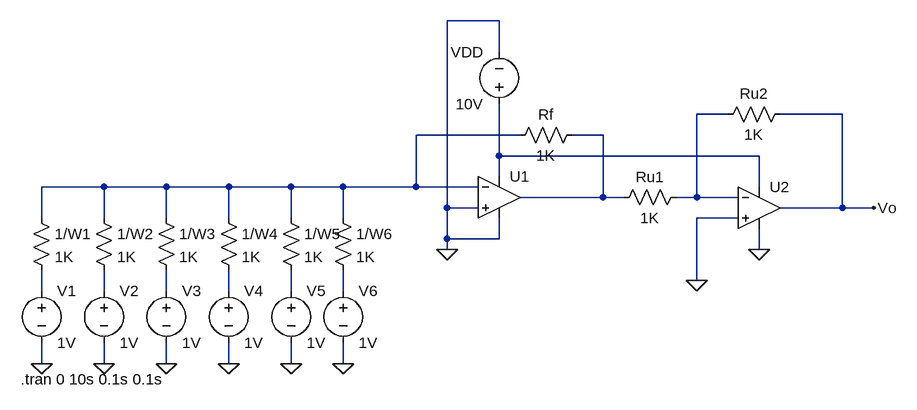
[diagram p0: schematic neuron-0.1.asc]
neuron-0.1.asc, the LTspice schematic file:
Version 4
SHEET 1 880 680
WIRE 256 -96 176 -96
WIRE 256 -48 256 -96
WIRE 608 48 560 48
WIRE 784 48 688 48
WIRE 288 80 128 80
WIRE 416 80 368 80
WIRE 256 112 256 32
WIRE 656 112 256 112
WIRE 256 144 256 112
WIRE -352 160 -448 160
WIRE -256 160 -352 160
WIRE -160 160 -256 160
WIRE -64 160 -160 160
WIRE 16 160 -64 160
WIRE 128 160 128 80
WIRE 128 160 16 160
WIRE 224 160 128 160
WIRE 656 160 656 112
WIRE 416 176 416 80
WIRE 416 176 288 176
WIRE 448 176 416 176
WIRE 560 176 560 48
WIRE 560 176 528 176
WIRE 624 176 560 176
WIRE 176 192 176 -96
WIRE 224 192 176 192
WIRE 784 192 784 48
WIRE 784 192 688 192
WIRE 832 192 784 192
WIRE -448 208 -448 160
WIRE -352 208 -352 160
WIRE -256 208 -256 160
WIRE -160 208 -160 160
WIRE -64 208 -64 160
WIRE 16 208 16 160
WIRE 624 208 560 208
WIRE 176 240 176 192
WIRE 256 240 256 208
WIRE 256 240 176 240
WIRE 176 256 176 240
WIRE 656 256 656 224
WIRE 560 304 560 208
WIRE -448 320 -448 288
WIRE -352 320 -352 288
WIRE -256 320 -256 288
WIRE -160 320 -160 288
WIRE -64 320 -64 288
WIRE 16 320 16 288
WIRE -448 432 -448 400
WIRE -352 432 -352 400
WIRE -256 432 -256 400
WIRE -160 432 -160 400
WIRE -64 432 -64 400
WIRE 16 432 16 400
FLAG 176 256 0
FLAG -448 432 0
FLAG -352 432 0
FLAG -256 432 0
FLAG -160 432 0
FLAG -64 432 0
FLAG 16 432 0
FLAG 656 256 0
FLAG 832 192 Vo
FLAG 560 304 0
SYMBOL OpAmps\\UniversalOpAmp 256 176 R0
SYMATTR InstName U1
SYMBOL voltage 256 48 R180
WINDOW 0 24 96 Left 2
WINDOW 3 24 16 Left 2
SYMATTR InstName VDD
SYMATTR Value 10V
SYMBOL voltage -352 304 R0
SYMATTR InstName V2
SYMATTR Value 1V
SYMBOL voltage -448 304 R0
SYMATTR InstName V1
SYMATTR Value 1V
SYMBOL voltage -256 304 R0
SYMATTR InstName V3
SYMATTR Value 1V
SYMBOL voltage -160 304 R0
SYMATTR InstName V4
SYMATTR Value 1V
SYMBOL voltage -64 304 R0
SYMATTR InstName V5
SYMATTR Value 1V
SYMBOL voltage 16 304 R0
SYMATTR InstName V6
SYMATTR Value 1V
SYMBOL res -464 192 R0
SYMATTR InstName 1/W1
SYMATTR Value 1K
SYMBOL res -368 192 R0
SYMATTR InstName 1/W2
SYMATTR Value 1K
SYMBOL res -272 192 R0
SYMATTR InstName 1/W3
SYMATTR Value 1K
SYMBOL res -176 192 R0
SYMATTR InstName 1/W4
SYMATTR Value 1K
SYMBOL res -80 192 R0
SYMATTR InstName 1/W5
SYMATTR Value 1K
SYMBOL res 0 192 R0
SYMATTR InstName 1/W6
SYMATTR Value 1K
SYMBOL res 384 64 R90
WINDOW 0 0 56 VBottom 2
WINDOW 3 32 56 VTop 2
SYMATTR InstName Rf
SYMATTR Value 1K
SYMBOL OpAmps\\UniversalOpAmp 656 192 R0
SYMATTR InstName U2
SYMBOL res 544 160 R90
WINDOW 0 0 56 VBottom 2
WINDOW 3 32 56 VTop 2
SYMATTR InstName Ru1
SYMATTR Value 1K
SYMBOL res 704 32 R90
WINDOW 0 0 56 VBottom 2
WINDOW 3 32 56 VTop 2
SYMATTR InstName Ru2
SYMATTR Value 1K
TEXT -480 456 Left 2 !.tran 0 10s 0.1s 0.1s

The netlist it stands for:
* neuron-0.1.asc
XU1 0 N002 N004 0 N003 level1 Avol=1Meg GBW=10Meg Vos=0 En=0 Enk=0 In=0 Ink=0 Rin=500Meg  ; pins In+ In- V+ V- OUT
VDD N004 0 10V
V2 N006 0 1V
V1 N005 0 1V
V3 N007 0 1V
V4 N008 0 1V
V5 N009 0 1V
V6 N010 0 1V
R§1/W1 N002 N005 1K
R§1/W2 N002 N006 1K
R§1/W3 N002 N007 1K
R§1/W4 N002 N008 1K
R§1/W5 N002 N009 1K
R§1/W6 N002 N010 1K
Rf N003 N002 1K
XU2 0 N001 N004 0 Vo level1 Avol=1Meg GBW=10Meg Vos=0 En=0 Enk=0 In=0 Ink=0 Rin=500Meg  ; pins In+ In- V+ V- OUT
Ru1 N001 N003 1K
Ru2 Vo N001 1K
.tran 0 10s 0.1s 0.1s
.lib UniversalOpAmp1.lib
.backanno
.end